# EAGLE schematic De-Humidifier revised (EAGLE 9.6.2)
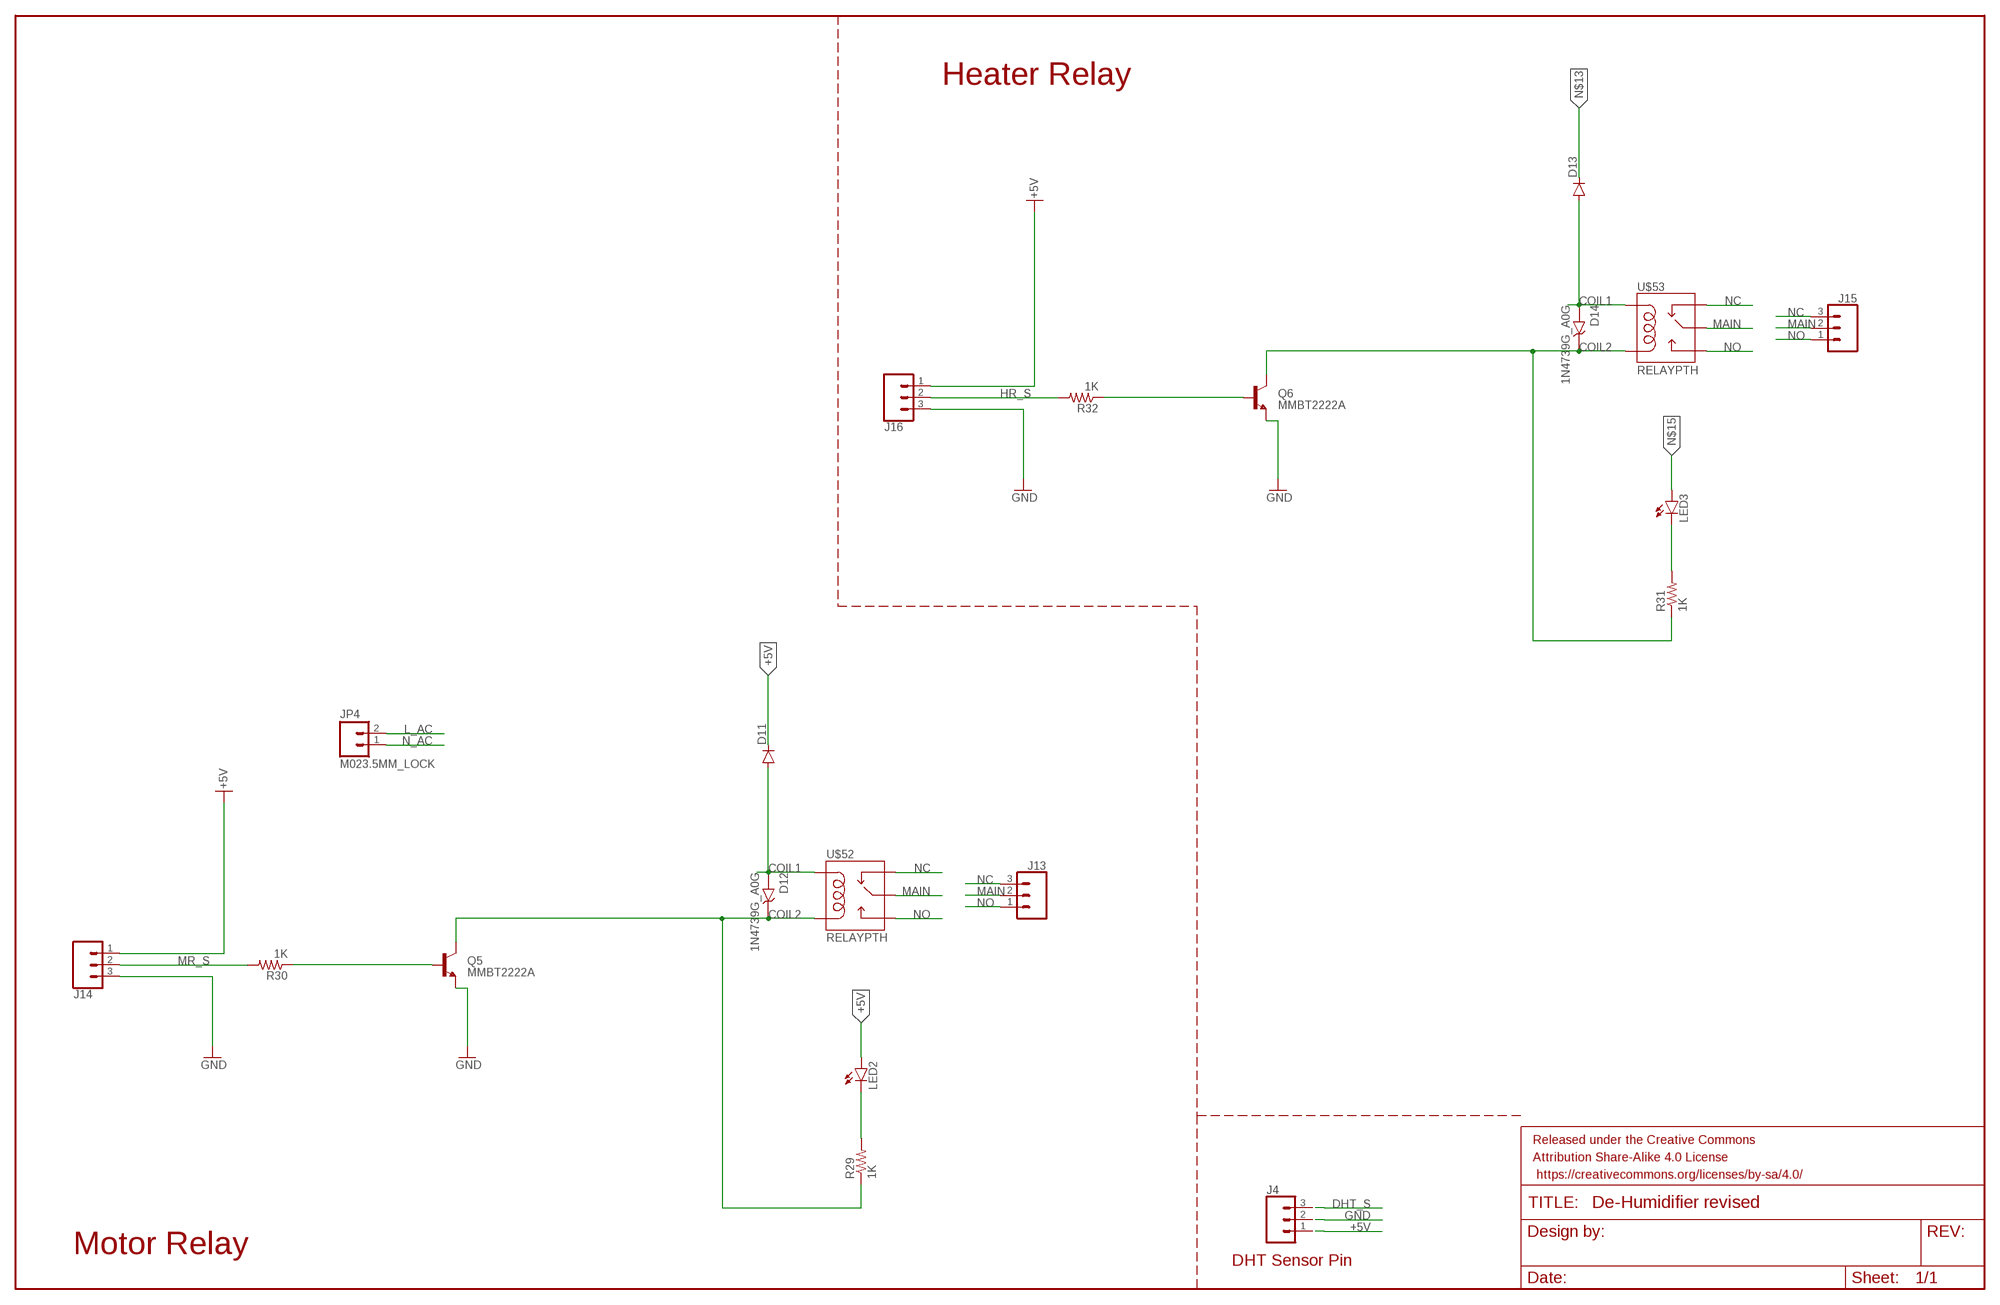
[diagram p0: schematic, sheet 1, part 1 of 2]
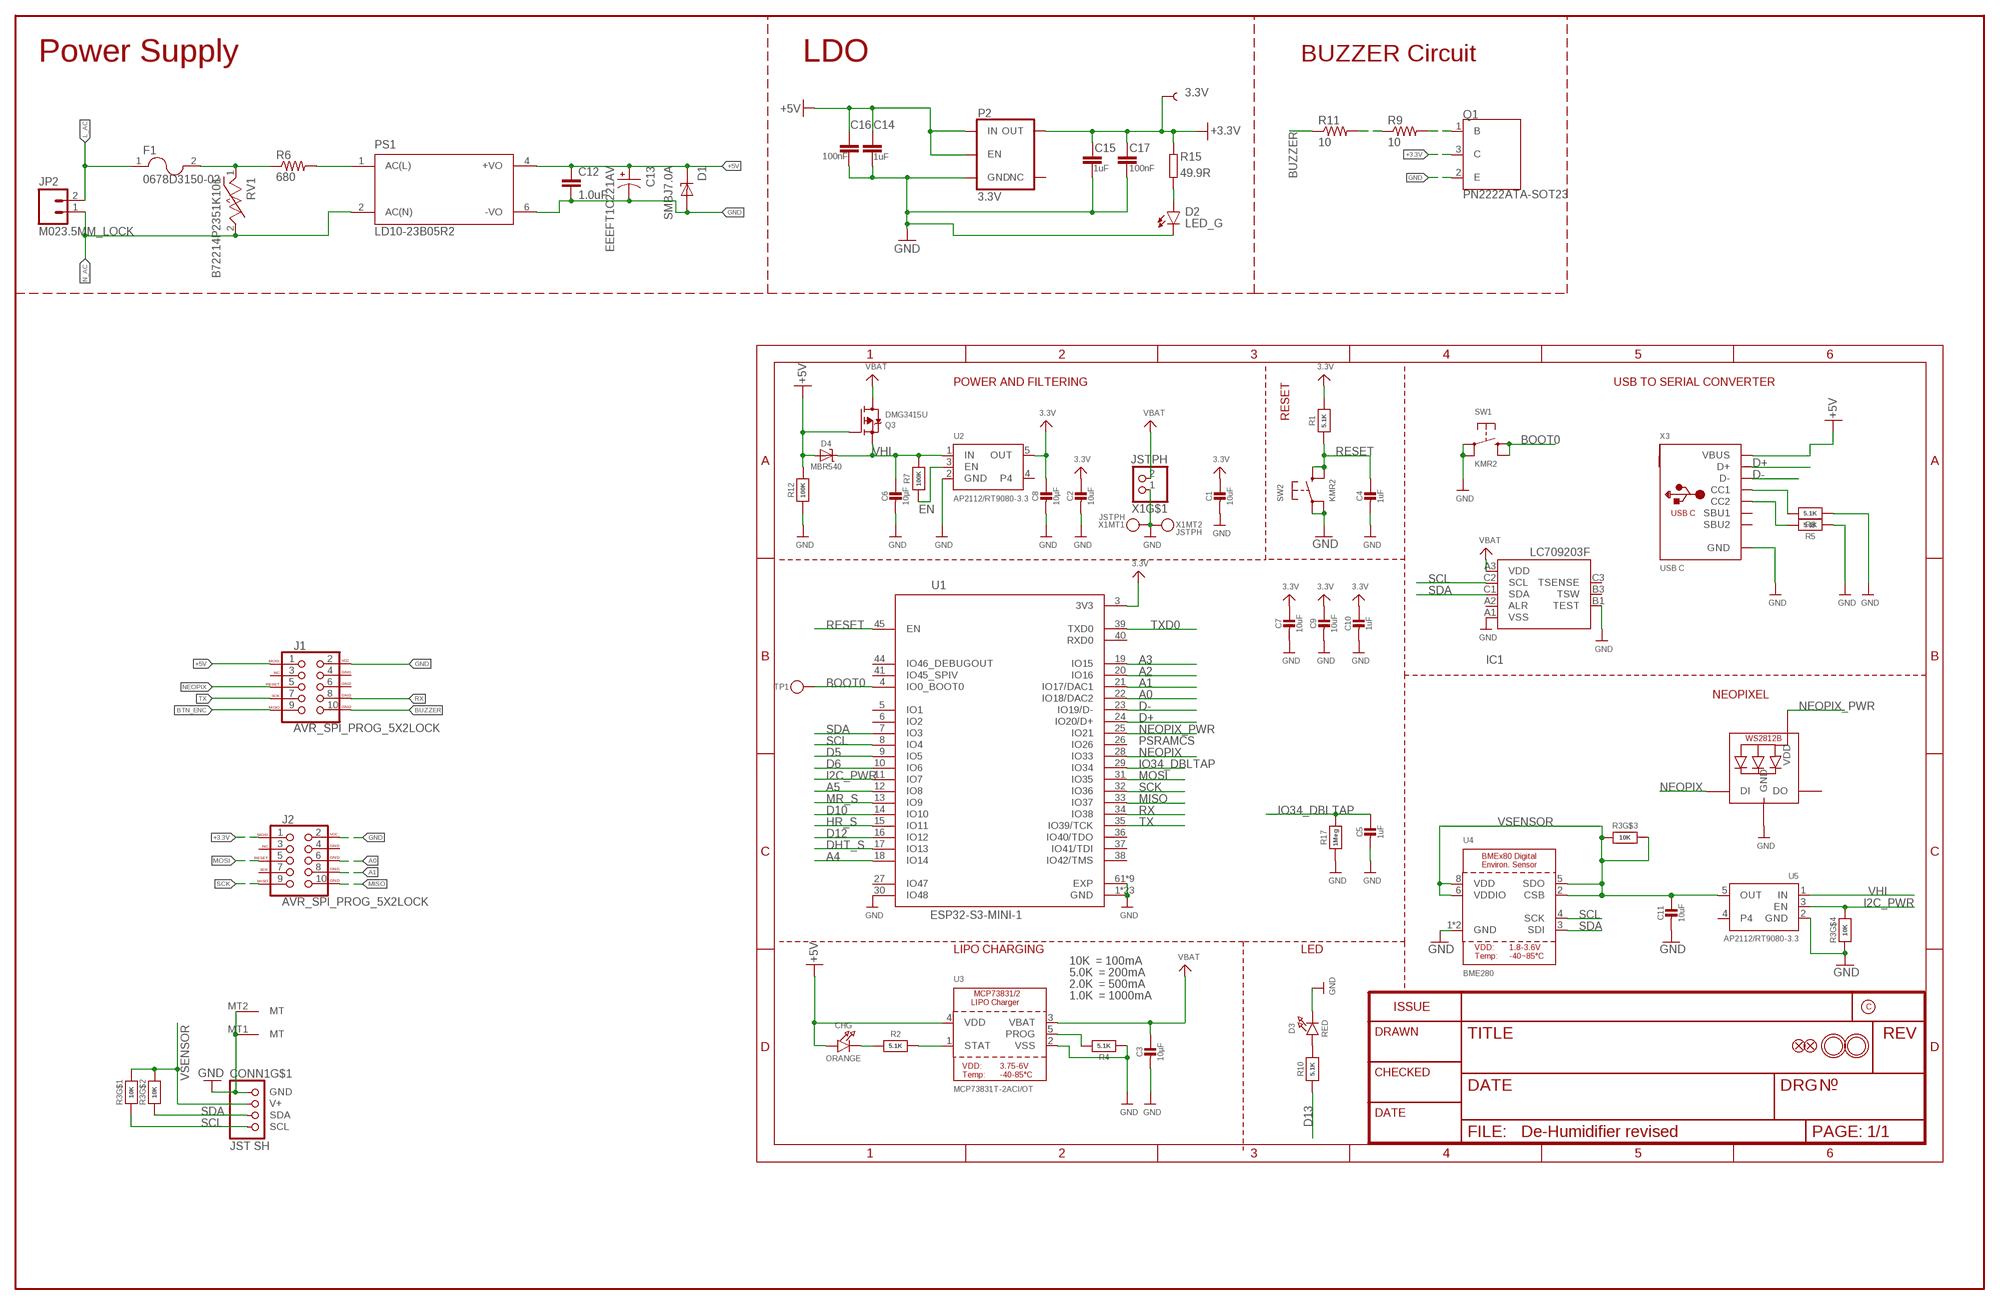
[diagram p1: schematic, sheet 1, part 2 of 2]

## Parts
3.3V  TEST-POINT3X4  [PAD.03X.04]
C1  10uF  CAP_CERAMIC0805-NOOUTLINE  [0805-NO]
C2  10uF  CAP_CERAMIC0805-NOOUTLINE  [0805-NO]
C3  10µF  CAP_CERAMIC0805-NOOUTLINE  [0805-NO]
C4  1uF  CAP_CERAMIC0603_NO  [0603-NO]
C5  1uF  CAP_CERAMIC0603_NO  [0603-NO]
C6  10µF  CAP_CERAMIC0805-NOOUTLINE  [0805-NO]
C7  10uF  CAP_CERAMIC0805-NOOUTLINE  [0805-NO]
C8  10µF  CAP_CERAMIC0805-NOOUTLINE  [0805-NO]
C9  10uF  CAP_CERAMIC0805-NOOUTLINE  [0805-NO]
C10  1uF  CAP_CERAMIC0603_NO  [0603-NO]
C11  10uF  CAP_CERAMIC_0805MP  [_0805MP]
C12  1.0uF  1.0UF-0805-25V-(+80/-20%)  [0805]
C13  EEEFT1C221AV  [CAP_EEEFT1C221AV]
C14  1uF  C_CHIP-0402(1005-METRIC)  [CAPC1005X60]
C15  1uF  C_CHIP-0402(1005-METRIC)  [CAPC1005X60]
C16  100nF  C_CHIP-0402(1005-METRIC)  [CAPC1005X60]
C17  100nF  C_CHIP-0402(1005-METRIC)  [CAPC1005X60]
CHG  ORANGE  LED0603_NOOUTLINE  [CHIPLED_0603_NOOUTLINE]
CONN1  JST SH  STEMMA_I2C_QTRA  [JST_SH4_RA]
D1  SMBJ7.0A  [DIOM4336X265N]
D2  LED_G  CHIP-FLAT-G_0603-0.35MM  [LEDC1608X35N_FLAT-G]
D3  RED  LED0603_NOOUTLINE  [CHIPLED_0603_NOOUTLINE]
D4  MBR540  DIODE-SCHOTTKYSOD-123  [SOD-123]
D11  DIODEKIT  [DIODE-1N4148-KIT]
D12  1N4739G_A0G  [DIOAD1036W73L450D282]
D13  DIODEKIT  [DIODE-1N4148-KIT]
D14  1N4739G_A0G  [DIOAD1036W73L450D282]
F1  0678D3150-02  [FUSC9830X318N]
FRAME2  FRAME-LEDGER  [CREATIVE_COMMONS]
FRAME3  FRAME-LEDGER  [CREATIVE_COMMONS]
IC1  LC709203F/MH  [WLCSP9]
J1  AVR_SPI_PROG_5X2LOCK  [2X5-SHROUDED_LOCK]
J2  AVR_SPI_PROG_5X2LOCK  [2X5-SHROUDED_LOCK]
J4  CONN_03LONGPADS  [1X03_LONGPADS]
J13  CONN_03-SCREW-5MM  [SCREWTERMINAL-5MM-3]
J14  CONN_03-SCREW-5MM  [SCREWTERMINAL-5MM-3]
J15  CONN_03-SCREW-5MM  [SCREWTERMINAL-5MM-3]
J16  CONN_03-SCREW-5MM  [SCREWTERMINAL-5MM-3]
JP2  M023.5MM_LOCK  [SCREWTERMINAL-3.5MM-2_LOCK]
JP4  M023.5MM_LOCK  [SCREWTERMINAL-3.5MM-2_LOCK]
LED1  WS2812B_SK6805_1515  [SK6805_1515]
LED2  LED-FKIT-1206  [FKIT-LED-1206]
LED3  LED-FKIT-1206  [FKIT-LED-1206]
P2  3.3V  V_REG_AP2112K-3.3V  [SOT23-5]
PS1  LD10-23B05R2  [CONV_LD10-23B05R2]
Q1  PN2222ATA-SOT23  [SOT23-3]
Q3  DMG3415U  MOSFET-P  [SOT23-R]
Q5  MMBT2222A  TRANSISTOR_NPNMMBT2222A  [SOT23-3]
Q6  MMBT2222A  TRANSISTOR_NPNMMBT2222A  [SOT23-3]
R1  5.1K  RESISTOR_0603_NOOUT  [0603-NO]
R2  5.1K  RESISTOR_0603_NOOUT  [0603-NO]
R3  10K  RESISTOR_4PACK  [RESPACK_4X0603]
R4  5.1K  RESISTOR_0603_NOOUT  [0603-NO]
R5  5.1K  RESISTOR_0603_NOOUT  [0603-NO]
R6  680  680OHM1/10W5%(0603)  [0603-RES]
R7  100K  RESISTOR_0603_NOOUT  [0603-NO]
R8  5.1K  RESISTOR_0603_NOOUT  [0603-NO]
R9  10  10OHM1/10W5%0603SMD  [0603-RES]
R10  5.1K  RESISTOR_0603_NOOUT  [0603-NO]
R11  10  10OHM1/10W5%0603SMD  [0603-RES]
R12  100K  RESISTOR_0603_NOOUT  [0603-NO]
R15  49.9R  R_CHIP-0402(1005-METRIC)  [RESC1005X40]
R17  1Meg  RESISTOR_0603_NOOUT  [0603-NO]
R29  1K  1KOHM1/10W1%(0603)  [0603-RES]
R30  1K  1KOHM1/10W1%(0603)  [0603-RES]
R31  1K  1KOHM1/10W1%(0603)  [0603-RES]
R32  1K  1KOHM1/10W1%(0603)  [0603-RES]
RV1  B72214P2351K101  [VAR_B72214P2351K101]
SW1  KMR2  SWITCH_TACT_SMT4.6X2.8  [BTN_KMR2_4.6X2.8]
SW2  KMR2  SWITCH_TACT_SMT4.6X2.8  [BTN_KMR2_4.6X2.8]
TP1  TESTPOINTROUND1.5MMNO  [TESTPOINT_ROUND_1.5MM_NO]
U1  ESP32-S3-MINI-1  [QFN60_ESP32-S2-MINI-1_EXP]
U2  AP2112/RT9080-3.3  VREG_SOT23-5  [SOT23-5]
U3  MCP73831T-2ACI/OT  MCP73831/2  [SOT23-5]
U4  BME280  [BME280]
U5  AP2112/RT9080-3.3  VREG_SOT23-5  [SOT23-5]
U$31  MOUNTINGHOLE2.5  [MOUNTINGHOLE_2.5_PLATED]
U$32  MOUNTINGHOLE2.5  [MOUNTINGHOLE_2.5_PLATED]
U$34  FIDUCIAL_1MM  [FIDUCIAL_1MM]
U$35  FIDUCIAL_1MM  [FIDUCIAL_1MM]
U$52  RELAYPTH  [RELAY-G5Q]
U$53  RELAYPTH  [RELAY-G5Q]
X1  JSTPH  CON_JST_PH_2PIN_MT_BATT  [JSTPH2_BATT]
X3  USB C  USB_C  [USB_C_CUSB31-CFM2AX-01-X]

## Nets
3.3V: C1.1 C2.1 C7.1 C8.1 C9.1 C10.1 R1.2 U1.3(3V3) U2.5(OUT)
+3.3V: 3.3V.P$1 C15.1 C17.1 J2.1(MOSI) P2.5(OUT) Q1.3(C) R15.2
+5V: C12.1 C13.1 C14.1 C16.1 CHG.A D1.C D4.A D11.C J1.1(MOSI) J4.1 J14.1 J16.1 LED2.A P2.1(IN) P2.3(EN) PS1.4(+VO) Q3.1(G) R12.2 U3.4(VDD) X3.A4B9(VBUS) X3.B4A9(VBUS)
A0: J2.6(GND) U1.22(IO18/DAC2)
A1: J2.8(GND) U1.21(IO17/DAC1)
A2: U1.20(IO16)
A3: U1.19(IO15)
A4: U1.18(IO14)
A5: U1.12(IO8)
BOOT0: SW1.B'(S1) SW1.B(S) TP1.P$1 U1.4(IO0_BOOT0)
BTN_ENC: J1.9(MISO)
BUZZER: J1.10(GND) R11.1
COIL1: D11.A D12.A D13.A D14.A U$52.5(COIL1) U$53.5(COIL1)
COIL2: D12.C(K) D14.C(K) Q5.3(C) Q6.3(C) R29.1 R31.1 U$52.1(COIL2) U$53.1(COIL2)
D5: U1.9(IO5)
D6: U1.10(IO6)
D10: U1.14(IO10)
D12: U1.16(IO12)
D13: R10.1
D+: U1.24(IO20/D+) X3.A6(D+) X3.B6(D+)
D-: U1.23(IO19/D-) X3.A7(D-) X3.B7(D-)
DHT_S: J4.3 U1.17(IO13)
EN: R7.1 U2.3(EN)
GND: C1.2 C2.2 C3.2 C4.2 C5.2 C6.2 C7.2 C8.2 C9.2 C10.2 C11.2 C12.2 C13.2 C14.2 C15.2 C16.2 C17.2 CONN1.1(GND) CONN1.MT1(MT) CONN1.MT2(MT) D1.A D2.C D3.C IC1.A1(VSS) IC1.B1(TEST) J1.2(VCC) J2.2(VCC) J4.2 J14.3 J16.3 LED1.4(GND) P2.2(GND) PS1.6(-VO) Q1.2(E) Q5.2(E) Q6.2(E) R3.4 R4.1 R5.1 R8.1 R12.1 R17.1 SW1.A'(P1) SW1.A(P) SW2.A'(P1) SW2.A(P) U1.1(GND) U1.2(GND) U1.30(IO48) U1.42(GND) U1.43(GND) U1.46(GND) U1.47(GND) U1.48(GND) U1.49(GND) U1.50(GND) U1.51(GND) U1.52(GND) U1.53(GND) U1.54(GND) U1.55(GND) U1.56(GND) U1.57(GND) U1.58(GND) U1.59(GND) U1.60(GND) U1.61(EXP) U1.62(GND) U1.63(GND) U1.64(GND) U1.65(GND) U1.66(EXP) U1.67(EXP) U1.68(EXP) U1.69(EXP) U1.70(EXP) U1.71(EXP) U1.72(EXP) U1.73(EXP) U2.2(GND) U3.2(VSS) U4.1(GND) U4.7(GND) U5.2(GND) X1.1 X1.NC1 X1.NC2 X3.A1B12(GND) X3.B1A12(GND)
HR_S: J16.2 R32.2 U1.15(IO11)
I2C_PWR: R3.5 U1.11(IO7) U5.3(EN)
IO34_DBLTAP: C5.1 R17.2 U1.29(IO34)
L_AC: F1.1 JP2.2 JP4.2
MAIN: J13.2 J15.2 U$52.2(MAIN) U$53.2(MAIN)
MISO: J2.10(GND) U1.33(IO37)
MOSI: J2.5(RESET) U1.31(IO35)
MR_S: J14.2 R30.2 U1.13(IO9)
N$1: CHG.C R2.1
N$2: F1.2 R6.1 RV1.1
N$3: R2.2 U3.1(STAT)
N$4: R4.2 U3.5(PROG)
N$5: D3.A R10.2
N$6: PS1.1(AC(L)) R6.2
N$7: Q1.1(B) R9.2
N$8: R8.2 X3.A5(CC1)
N$9: R5.2 X3.B5(CC2)
N$10: R9.1 R11.2
N$12: D2.A R15.1
N$13: D13.C
N$15: LED3.A
N$37: LED2.C R29.2
N$38: Q5.1(B) R30.1
N$40: LED3.C R31.2
N$41: Q6.1(B) R32.1
N_AC: JP2.1 JP4.1 PS1.2(AC(N)) RV1.2
NC: J13.3 J15.3 U$52.4(NC) U$53.4(NC)
NEOPIX: J1.5(RESET) LED1.1(DI) U1.28(IO33)
NEOPIX_PWR: LED1.2(VDD) U1.25(IO21)
NO: J13.1 J15.1 U$52.3(NO) U$53.3(NO)
RESET: C4.1 R1.1 SW2.B'(S1) SW2.B(S) U1.45(EN)
RX: J1.8(GND) U1.34(IO38)
SCK: J2.9(MISO) U1.32(IO36)
SCL: CONN1.4(SCL) IC1.C2(SCL) R3.1 U1.8(IO4) U4.4(SCK)
SDA: CONN1.3(SDA) IC1.C1(SDA) R3.2 U1.7(IO3) U4.3(SDI)
TX: J1.7(SCK) U1.35(IO39/TCK)
TXD0: U1.39(TXD0)
VBAT [Power]: C3.1 IC1.A3(VDD) Q3.3(D) U3.3(VBAT) X1.2
VHI [Power]: C6.1 D4.C Q3.2(S) R7.2 U2.1(IN) U5.1(IN)
VSENSOR [Power]: C11.1 CONN1.2(V+) R3.3 R3.6 R3.7 R3.8 U4.2(CSB) U4.5(SDO) U4.6(VDDIO) U4.8(VDD) U5.5(OUT)
Unconnected: IC1.A2(ALR) IC1.B3(TSW) IC1.C3(TSENSE) J1.3(NC) J2.3(NC) J2.7(SCK) LED1.3(DO) P2.4(NC) U1.5(IO1) U1.6(IO2) U1.26(IO26) U1.27(IO47) U1.36(IO40/TDO) U1.37(IO41/TDI) U1.38(IO42/TMS) U1.40(RXD0) U1.41(IO45_SPIV) U1.44(IO46_DEBUGOUT) U2.4 U5.4 X3.A8(SBU1) X3.B8(SBU2)

## Notes on the sheet
- Heater Relay
- Motor Relay
- DHT Sensor Pin
- Power Supply | LDO | BUZZER Circuit
- POWER AND FILTERING | USB TO SERIAL CONVERTER
- RESET
- NEOPIXEL
- PSRAMCS
- LIPO CHARGING | LED
- 10K  = 100mA
- 5.0K  = 200mA
- 2.0K  = 500mA
- 1.0K  = 1000mA

## Power pins joined to a net without a drawn wire
GND: J1.4(GND) J1.6(GND) J2.4(GND)

## Library data of the parts
3.3V = SparkFun-Connectors:TEST-POINT: SparkFun Test Points Bare copper test points for troubleshooting or In-Circuit-Testing. These are used by our Production team for verifying production board runs using pogo-pins on test beds. SparkFun Products: SparkFun LSM9DS1 Breakout <https://www.sparkfun.com/products/13284> SparkFun PSOC <https://www.sparkfun.com/products/13714> SparkFun Load Cell Amplifier <https://www.sparkfun.com/products/13879>
C1-C7 C9-C11 = microbuilder:CAP_CERAMIC: Ceramic Capacitors For new designs, use the packages preceded by an '_' character since they are more reliable: The following footprints should be used on most boards: _0402 - Standard footprint for regular board layouts _0603 - Standard footprint for regular board layouts _0805 - Standard footprint for regular board layouts _1206 - Standard footprint for regular board layouts For extremely tight-pitch boards where space is at a premium, the following 'micro-pitch' footprints can be used (smaller pads, no silkscreen outline, etc.): _0402MP - Micro-pitch footprint for very dense/compact boards _0603MP - Micro-pitch footprint for very dense/compact boards _0805MP - Micro-pitch footprint for very dense/compact boards _1206MP - Micro-pitch footprint for very dense/compact boards
C8 = microbuilder:CAP_CERAMIC: Ceramic Capacitors For new designs, use the packages preceded by an '_' character since they are more reliable: The following footprints should be used on most boards: _0402 - Standard footprint for regular board layouts _0603 - Standard footprint for regular board layouts _0805 - Standard footprint for regular board layouts _1206 - Standard footprint for regular board layouts For extremely tight-pitch boards where space is at a premium, the following 'micro-pitch' footprints can be used (smaller pads, no silkscreen outline, etc.): _0402MP - Micro-pitch footprint for very dense/compact boards _0603MP - Micro-pitch footprint for very dense/compact boards _0805MP - Micro-pitch footprint for very dense/compact boards _1206MP - Micro-pitch footprint for very dense/compact boards; REV: C
C12 = SparkFun-Capacitors:1.0UF: 1µF ceramic capacitors A capacitor is a passive two-terminal electrical component used to store electrical energy temporarily in an electric field.; PROD_ID: CAP-11625
C13 = EEEFT1C221AV:EEEFT1C221AV: Check availability <https://pricing.snapeda.com/parts/EEE-FT1C221AV/Panasonic%20Electronic%20Components/view-part?ref=eda>; AVAILABILITY: In Stock; CHECK_PRICES: https://www.snapeda.com/parts/EEE-FT1C221AV/Panasonic/view-part/?ref=eda; DESCRIPTION: CAP ALUM 220UF 20% 16V SMD; MF: Panasonic Electronic Components; MP: EEE-FT1C221AV; PACKAGE: RADIAL-2 Panasonic; PRICE: None; PURCHASE-URL: https://www.snapeda.com/api/url_track_click_mouser/?unipart_id=6178542&manufacturer=Panasonic Electronic Components&part_name=EEE-FT1C221AV&search_term=220uf 16v; SNAPEDA_LINK: https://www.snapeda.com/parts/EEE-FT1C221AV/Panasonic/view-part/?ref=snap
C14 C15 = Fracktal Misc Lib:C: Capacitor - Generic; CATEGORY: Capacitor; LCSCPN#: C52923
C16 C17 = Fracktal Misc Lib:C: Capacitor - Generic; CATEGORY: Capacitor; LCSCPN#: C307331
CHG D3 = microbuilder:LED: LED 0603 - 0603 Surface Mount Package 2mA: Green LED - Low Power (3.9mcd, 2ma, 1.7Vf) - Digikey: 475-2709-2-ND Orange LED - Low Power (9.8mcd, 2ma, 1.8Vf) - Digikey: 475-1194-2-ND Red LED - Low Power (5mcd, 2ma, 1.8Vf) - Digikey: 475-1195-2-ND Yellow LED - Low Power (7mcd, 2ma, 1.8Vf) - Digikey: 475-1196-2-ND 5mA: Blue LED - Low Power (17mcd, 5ma, 2.9Vf) - Digikey: LNJ937W8CRACT-ND 0805 - 0805 Surface Mount Package 2mA: Red LED (8.8mcd, 2mA, 1.8Vf, Clear) - Low Power [Digikey: 475-2510-1-ND] Green LED (5mcd, 2mA, 1.8Vf, Clear) - Low Power [Digikey: 475-2730-1-ND] Yellow LED (11.3mcd, 2mA, 1.8Vf, Clear) - Low Power [Digikey: 475-2555-1-ND] 20mA: Red LED (104mcd, 20mA, Diffused) - LS R976 [Digikey: 475-1278-6-ND] Red LED (12mcd, 20mA, 2.0Vf, Clear) - APT2012EC [Digikey: 754-1128-1-ND] Green LED (15mcd, 20mA, 2.2Vf, Clear) - APT2012GC [Digikey: 754-1131-1-ND] Orange LED (160mcd, 20mA, 2.1Vf, Clear) - APT2012SECK [Digikey: 754-1130-1-ND] 1206 - 1206 Surface Mount Package Green LED (26mcd, 20mA, Diffused) - LG N971 [Digikey: 475-1407-6-ND] Red LED (15mcd, 20mA, Diffused) - LH N974 [Digikey: 475-1416-6-ND] Cree - Cree High-Power Surface Mount LEDs XPEBWT-L1-0000-00D50 - White 111lm 350mA 2.9Vf 6200K 110° XTEAWT-00-0000-00000LEE3 - White 114lm 350mA 2.85Vf 5000K 115° Everlight - Everlight 45-21 Series Surface Mount LEDs 45-21/QK2C-B2832AC2CB2/2T - Warm White 2000mcd 20mA 3.25Vf 3050K 120° 45-21/LK2C-B38452C4CB2/2T - Nuetral White 2000mcd 20mA 3.25Vf 4150K 120° 45-21/LK2C-B50634C6CB2/2T - Cold White 2200mcd 20mA 3.25Vf 5650K 120° PLCC2 Reverse Mount LS T77K-J1L2-1-0-2-R18-Z - Red 11.25mcd 2mA 1.8Vf 630nm 120° LO T77K-L1M2-24-Z - Orange 19.6mcd 2mA 1.8Vf 606nm 120° LY T77K-K2M1-26-Z - Yellow 15.7mcd 2mA 1.8Vf 587nm 120°
CONN1 = microbuilder:STEMMA_I2C
D1 = SMBJ7.0A:SMBJ7.0A: Check availability <https://pricing.snapeda.com/parts/SMBJ7.0A/Littelfuse/view-part?ref=eda>; AVAILABILITY: In Stock; CHECK_PRICES: https://www.snapeda.com/parts/SMBJ7.0A/Littelfuse/view-part/?ref=eda; DESCRIPTION: 600W Surface Mount TVS Diode | Littelfuse SMBJ7.0A; MF: Littelfuse; MP: SMBJ7.0A; PACKAGE: DO-214 Littelfuse; PRICE: None; PURCHASE-URL: https://www.snapeda.com/api/url_track_click_mouser/?unipart_id=185729&manufacturer=Littelfuse&part_name=SMBJ7.0A&search_term=smbj7.0a; SNAPEDA_LINK: https://www.snapeda.com/parts/SMBJ7.0A/Littelfuse/view-part/?ref=snap
D2 = LED:CHIP-FLAT-G; CATEGORY: LED; COLOR: GREEN; DESCRIPTION: CHIP LED FLAT; LCSCPN#: C72043; SUB-CATEGORY: CHIP; TYPE: FLAT_TOP; VALUE: LED_GREEN
D4 = microbuilder:DIODE-SCHOTTKY
D11 D13 = SparkFun-DiscreteSemi:DIODE: Diode These are standard reverse protection diodes and small signal diodes. SMA package can handle up to about 1A. SOD-323 can handle about 200mA. What the SOD-323 package when ordering, there are some mfgs out there that are 5-pin packages.
D12 D14 = 1N4739G_A0G:1N4739G_A0G: Check availability <https://pricing.snapeda.com/parts/1N4739G%20A0G/Taiwan%20Semiconductor/view-part?ref=eda>; AVAILABILITY: In Stock; CHECK_PRICES: https://www.snapeda.com/parts/1N4739G%20A0G/Taiwan+Semiconductor/view-part/?ref=eda; DESCRIPTION: DO-204AL (DO-41), 1000mW, 5%, Small Signal Zener Diode; MF: Taiwan Semiconductor; MP: 1N4739G A0G; PACKAGE: DO-41-2 Taiwan Semiconductor; PRICE: None; PURCHASE-URL: https://www.snapeda.com/api/url_track_click_mouser/?unipart_id=9408030&manufacturer=Taiwan Semiconductor&part_name=1N4739G A0G&search_term=1n4739; SNAPEDA_LINK: https://www.snapeda.com/parts/1N4739G%20A0G/Taiwan+Semiconductor/view-part/?ref=snap
F1 = 0678D3150-02:0678D3150-02: Surface mount "brick" | Ceramic Tube | 3912 case size | Fast Acting | 500mA Check availability <https://pricing.snapeda.com/parts/0678D3150-02/Bel%20Fuse/view-part?ref=eda>; AVAILABILITY: In Stock; CHECK_PRICES: https://www.snapeda.com/parts/0678D3150-02/Bel+Fuse/view-part/?ref=eda; DESCRIPTION: Surface mount brick | Ceramic Tube | 3912 case size | Fast Acting | 3.15A; MF: Bel Fuse; MP: 0678D3150-02; PACKAGE: SMD-2 Bel Fuse Inc.; PRICE: None; PURCHASE-URL: https://www.snapeda.com/api/url_track_click_mouser/?unipart_id=4616239&manufacturer=Bel Fuse&part_name=0678D3150-02&search_term=0678d3150-02; SNAPEDA_LINK: https://www.snapeda.com/parts/0678D3150-02/Bel+Fuse/view-part/?ref=snap
FRAME2 FRAME3 = SparkFun-Aesthetics:FRAME-LEDGER: Schematic Frame Standard 11x14 US Ledger frame
IC1 = adafruit_sensor:LC709203F
J1 J2 = SparkFun-Connectors:AVR_SPI_PROG_5X2: AVR 10-pin ICSP Header This is the standard AVR In Circuit Serial Programming header. Minimal, but includes pin one indicator. Works with standard Olimex programmers. SparkFun Products: 2x5 AVR ICSP Male Header <https://www.sparkfun.com/products/778> - PTH 2x5 Pin Shrouded Header <https://www.sparkfun.com/products/8506> - PTH2; PROD_ID: CONN-08671; SF_ID: PRT-08506
J4 = SparkFun-Connectors:CONN_03: Multi connection point. Often used as Generic Header-pin footprint for 0.1 inch spaced/style header connections On any of the 0.1 inch spaced packages, you can populate with these: Break Away Headers - Straight <https://www.sparkfun.com/products/116> (PRT-00116) Break Away Male Headers - Right Angle <https://www.sparkfun.com/products/553> (PRT-00553) Female Headers <https://www.sparkfun.com/products/115> (PRT-00115) Break Away Headers - Machine Pin <https://www.sparkfun.com/products/117> (PRT-00117) Break Away Female Headers - Swiss Machine Pin <https://www.sparkfun.com/products/743> (PRT-00743) Stackable Header - 3 Pin (Female, 0.1") <https://www.sparkfun.com/products/13875> (PRT-13875) For SCREWTERMINALS and SPRING TERMINALS visit here: Screw Terimnals on SparkFun.com <https://www.sparkfun.com/search/results?term=Screw+Terminals> (5mm/3.5mm/2.54mm spacing) This device is also useful as a general connection point to wire up your design to another part of your project. Our various solder wires solder well into these plated through hole pads. Hook-Up Wire - Assortment (Stranded, 22 AWG) <https://www.sparkfun.com/products/11375> (PRT-11375) Hook-Up Wire - Assortment (Solid Core, 22 AWG) <https://www.sparkfun.com/products/11367> (PRT-11367) View the entire wire category on our website here <https://www.sparkfun.com/categories/141> Special notes: Molex polarized connector foot print use with SKU : PRT-08232 with associated crimp pins and housings.
J13-J16 = SparkFun-Connectors:CONN_03: Multi connection point. Often used as Generic Header-pin footprint for 0.1 inch spaced/style header connections On any of the 0.1 inch spaced packages, you can populate with these: Break Away Headers - Straight <https://www.sparkfun.com/products/116> (PRT-00116) Break Away Male Headers - Right Angle <https://www.sparkfun.com/products/553> (PRT-00553) Female Headers <https://www.sparkfun.com/products/115> (PRT-00115) Break Away Headers - Machine Pin <https://www.sparkfun.com/products/117> (PRT-00117) Break Away Female Headers - Swiss Machine Pin <https://www.sparkfun.com/products/743> (PRT-00743) Stackable Header - 3 Pin (Female, 0.1") <https://www.sparkfun.com/products/13875> (PRT-13875) For SCREWTERMINALS and SPRING TERMINALS visit here: Screw Terimnals on SparkFun.com <https://www.sparkfun.com/search/results?term=Screw+Terminals> (5mm/3.5mm/2.54mm spacing) This device is also useful as a general connection point to wire up your design to another part of your project. Our various solder wires solder well into these plated through hole pads. Hook-Up Wire - Assortment (Stranded, 22 AWG) <https://www.sparkfun.com/products/11375> (PRT-11375) Hook-Up Wire - Assortment (Solid Core, 22 AWG) <https://www.sparkfun.com/products/11367> (PRT-11367) View the entire wire category on our website here <https://www.sparkfun.com/categories/141> Special notes: Molex polarized connector foot print use with SKU : PRT-08232 with associated crimp pins and housings.; PROD_ID: CONN-10134; SF_SKU: PRT-08433
JP2 JP4 = SparkFun-Connectors:M02: Standard 2-pin 0.1" header. Use with - straight break away headers ( PRT-00116) - right angle break away headers (PRT-00553) - swiss pins (PRT-00743) - machine pins (PRT-00117) - female headers (PRT-00115) Molex polarized connector foot print use with: PRT-08233 with associated crimp pins and housings. 2.54_SCREWTERM for use with PRT-10571. 3.5mm Screw Terminal footprints for PRT-08084 5mm Screw Terminal footprints for use with PRT-08432
LED1 = microbuilder:WS2812B
LED2 LED3 = SparkFun-LED:LED: LEDs Standard schematic elements and footprints for 5mm, 3mm, 1206, and 0603 sized LEDs. 5mm - Spark Fun Electronics SKU : COM-00529 (and others)
P2 = SparkFun-IC-Power:V_REG_AP2112: AP2112 - 600mA CMOS LDO Regulator w/ Enable The AP2112 is CMOS process low dropout linear regulator with enable function, the regulator delivers a guaranteed 600mA (min.) continuous load current. Features Output Voltage Accuracy: ±1.5% Output Current: 600mA (Min.) Foldback Short Current Protection: 50mA Enable Function to Turn ON/OFF VOUT Low Dropout Voltage (3.3V): 250mV (Typ.) @IOUT=600mA Excellent Load Regulation: 0.2%/A (Typ.) Excellent Line Regulation: 0.02%/V (Typ.) Low Quiescent Current: 55μA (Typ.) Low Standby Current: 0.01μA (Typ.) Low Output Noise: 50μVRMS PSRR: 100Hz -65dB, 1kHz -65dB OTSD Protection Stable with 1.0μF Flexible Cap: Ceramic, Tantalum and Aluminum Electrolytic Operation Temperature Range: -40°C to 85°C ESD: MM 400V, HBM 4000V; LCSCPN#: C51118; PROD_ID: VREG-12457
PS1 = LD10-23B05R2:LD10-23B05R2: AC/DC Converter Check availability <https://pricing.snapeda.com/parts/LD10-23B05R2/Mornsun%20America%2C%20LLC/view-part?ref=eda>; AVAILABILITY: In Stock; CHECK_PRICES: https://www.snapeda.com/parts/LD10-23B05R2/MORNSUN/view-part/?ref=eda; DESCRIPTION: Enclosed AC DC Converters 1 Uitgang 5V - - - 2A 85 ~ 305 VAC, 100 ~ 430 VDC Input; MF: Mornsun America, LLC; MP: LD10-23B05R2; PACKAGE: CUSTOM-4 MORNSUN; PRICE: None; PURCHASE-URL: https://www.snapeda.com/api/url_track_click_mouser/?unipart_id=5507490&manufacturer=Mornsun America, LLC&part_name=LD10-23B05R2&search_term=None; SNAPEDA_LINK: https://www.snapeda.com/parts/LD10-23B05R2/MORNSUN/view-part/?ref=snap
Q1 = PN2222ATA:PN2222ATA: PN2222ATA transistor Check availability <https://pricing.snapeda.com/parts/PN2222ATA/onsemi/view-part?ref=eda>; AVAILABILITY: In Stock; CHECK_PRICES: https://www.snapeda.com/parts/PN2222ATA/Onsemi/view-part/?ref=eda; DESCRIPTION: Bipolar (BJT) Transistor NPN 40 V 1 A 300MHz 625 mW Through Hole TO-92-3; MF: onsemi; MP: PN2222ATA; PACKAGE: None; PRICE: None; PURCHASE-URL: https://www.snapeda.com/api/url_track_click_mouser/?unipart_id=7399020&manufacturer=onsemi&part_name=PN2222ATA&search_term=pn2222a w73; SNAPEDA_LINK: https://www.snapeda.com/parts/PN2222ATA/Onsemi/view-part/?ref=snap
Q3 = microbuilder:MOSFET-P: P-Channel Mosfet LEGEND VDS: Voltage Drain-Source ID: Drain Current RDS(ON): Drain-Source On-State Resistance VGS(TH): Gate-Source Threshold Voltage CISS: Drain-Source Input Capacitance SOT-23 Name VDS ID RDS(ON) VGS(TH) CISS Order Number IRLML5103 30V 760mA 600 mOhm -- 75pF @ 25V Digikey: IRLML5103PBFCT-ND IRLML6401 12V 4.3A 50 mOhm 950mV @ 250µA 830pF @ 10V Digikey: IRLML6401PBFTR-ND NTR0202PL 20V 400mA 800 mOhm 2.3V @ 250uA 70pF @ 5V Digikey: NTR0202PLT1GOSTR-ND NTR4101PT1G 20V 1.8A 85 mOhm 1.2V @ 250uA 675pF @ 10V Digikey: NTR4101PT1GOSCT-ND DMP2004K 20V 600mA 900 mOhm 1V @ 250uA 175pF @ 16V Digikey: DMP2004KDICT-ND PMV65XP 20V 3.9A 76 mOhm 950mV @ 1mA 725pF @ 20V Digikey: 568-2358-2-ND TO-252 Name VDS ID RDS(ON) VGS(TH) CISS Order Number AOD417 30V 25A 34 mOhm 3V @ 250µA 920pF @ 15V Digikey: 785-1106-2-ND PowerPak Name VDS ID RDS(ON) VGS(TH) CISS Order Number AON7401 30V 12A 14 mOhm 3V @ 250µA 2600pF @ 15V Digikey: 785-1302-1-ND
Q5 Q6 = SparkFun-DiscreteSemi:TRANSISTOR_NPN: Generic NPN BJT MMBT2222A - TRANS-08049 (SOT-23, 1A 40V) MPSA42 - TRANS-09116 (SOT-23, 500mA 300V) MMBT5088LT1G - TRANS-11160 (SOT-23, 50 mA 30V) BC547 - COM-08928 <http://www.sparkfun.com/products/8928> (TO-92 45V 100mA) (1.Collector 2.Base 3.Emitter) 2N3904 - COM-00521 <http://www.sparkfun.com/products/521> (TO-92 40V 200mA) (1.Emitter 2.Base 3.Collector) P2N2222A - COM-12852 <http://www.sparkfun.com/products/12852> (TO-92 40V 600mA) (1.Collector 2.Base 3.Emitter); PROD_ID: TRANS-08049
R1 R2 R4 R5 R7 R8 R10 R12 R17 = microbuilder:RESISTOR: Resistors For new designs, use the packages preceded by an '_' character since they are more reliable: The following footprints should be used on most boards: _0402 - Standard footprint for regular board layouts _0603 - Standard footprint for regular board layouts _0805 - Standard footprint for regular board layouts _1206 - Standard footprint for regular board layouts For extremely tight-pitch boards where space is at a premium, the following 'micro-pitch' footprints can be used (smaller pads, no silkscreen outline, etc.): _0402MP - Micro-pitch footprint for very dense/compact boards _0603MP - Micro-pitch footprint for very dense/compact boards _0805MP - Micro-pitch footprint for very dense/compact boards _1206MP - Micro-pitch footprint for very dense/compact boards
R3 = microbuilder:RESISTOR_4PACK: Resistor Packs (4 resistors) 4 x 0603 10K 1/16W - Digikey: YC164J-10KCT-ND
R6 = SparkFun-Resistors:680OHM1/10W5%(0603): RES-09333; PROD_ID: RES-09333
R9 R11 = SparkFun-Resistors:10OHM1/10W5%0603: RES-09834; PROD_ID: RES-09834
R15 = Fracktal Misc Lib:R: Resistor Fixed - Generic; CATEGORY: Resistor; LCSCPN#: C25120; SUB-CATEGORY: Fixed
R29-R32 = SparkFun-Resistors:1KOHM1/10W1%(0603): RES-07856; PROD_ID: RES-07856
RV1 = B72214P2351K101:B72214P2351K101: Check availability <https://pricing.snapeda.com/parts/B72214P2351K101/EPCOS/view-part?ref=eda>; AVAILABILITY: In Stock; CHECK_PRICES: https://www.snapeda.com/parts/B72214P2351K101/EPCOS/view-part/?ref=eda; DESCRIPTION: 560 V 6 kA Varistor 1 Circuit Through Hole Disc 16.5mm; MF: EPCOS; MP: B72214P2351K101; PACKAGE: Disc-16 EPCOS; PRICE: None; PURCHASE-URL: https://www.snapeda.com/api/url_track_click_mouser/?unipart_id=1312197&manufacturer=EPCOS&part_name=B72214P2351K101&search_term=560v mov; SNAPEDA_LINK: https://www.snapeda.com/parts/B72214P2351K101/EPCOS/view-part/?ref=snap
SW1 SW2 = microbuilder:SWITCH_TACT_SMT: SMT Tact Switches 6x6mm - Digikey: P12940SCT-ND KMR2 (4.6x2.8mm) - Digikey: 401-1426-1-ND EVQ-PQHB55 - Light Touch, 160GF (4.5x4.5mm) - Digikey: P8090SCT-ND KMT0 - KMT021 NGJ LHS (etc.) IP68/Waterproof - Digikey: CKN10289CT-ND
TP1 = microbuilder:TESTPOINT: Test Point Various test points for characterisation and PCB testing TESTPOINT_SMT - Compact Surface Mount Test Point [Digikey: 5016KTR-ND]
U1 = adafruit_wireless:ESP32-S3-MINI-1; BUILT_BY: EMA_Kyle; COPYRIGHT: Copyright (C) 2018 Accelerated Designs. All rights reserved; DATASHEET: https://www.espressif.com/sites/default/files/documentation/esp32-s2-mini-1_esp32-s2-mini-1u_datasheet_en.pdf; MANUFACTURER_PART_NUMBER: ESP32-S2-MINI-1; SOURCELIBRARY: Add_to_database_2020-11-03; VENDOR: Espressif Systems
U2 U5 = microbuilder:VREG_SOT23-5: SOT23-5 Fixed Voltage Regulators Part Current Out V Out V In V Dropout θJA (°C/W) TJ (°C) Digikey Part No. ADP121 150mA 3.3V 3.4-5.5V 0.09V @ 150mA -- -- ADP121-AUJZ33R7CT-ND ADP121 150mA 3.0V 3.1-5.5V 0.09V @ 150mA -- -- ADP121-AUJZ30R7CT-ND ADP122 300mA 3.3V 3.4-5.5V 0.085V @ 300mA -- -- ADP122AUJZ-3.3-R7CT-ND ADP1712 300mA 3.3V 3.5-5.5V 0.17V @ 300mA -- -- ADP1712AUJZ-3.3-R7TR-ND AP7311 (Low Cost) 150mA 3.3V 3.5-6V 0.15V @ 150mA -- -- AP7311-33WG-7DICT-ND LD39015M18R 150mA 1.8V 1.9V-5.5V 0.08V @ 100mA -- -- 497-6977-1-ND LP2985A-33DBVR 150mA 3.3V 3.3-16V 0.28V @ 150mA 206 150 296-18479-1-ND MCP1824T-3302E/OT 300mA 3.3V 3.5V-6V 0.2V @ 300mA -- -- MCP1824T-3302E/OTCT-ND MIC5205-2.5YM5 TR 150mA 2.5V 2.7-16V 0.165V @ 150mA -- -- 576-1257-2-ND MIC5205-3.0YM5 TR 150mA 3.0V 3.2V-16V 0.165V @ 150mA -- -- 576-1258-2-ND MIC5205-3.3YM5 TR 150mA 3.3V 3.5V-16V 0.165V @ 150mA -- -- 576-1259-2-ND TPS780330220 150mA 3.3V+2.2V 3.6-5.5V 250mV Max -- -- 296-23332-1-ND TDA3663/N1,135 100mA 3.3V 3.5-45V 0.18V @ 50mA -- -- 568-5343-1-ND Max operating temp can be calculated using θJA, TJ (max junction temperature), and power in watts. Set the "Maximum Ambient Temperature" until it reaches TJ ("Max Junction Temperature"), which is the absolute limit for safe use of the regulator: Heat Sink Temperature Calculator <http://www.daycounter.com/Calculators/Heat-Sink-Temperature-Calculator.phtml> For example, With 12V source into a 3.3V LP2985 and a 30mA load, we are dissipating (12V-3.3V) * 0.03A = 0.261W. With a θJA of 206 °C/W, a TJ of 150°C, and 261mW we can safely use the chip without a heat sink up to 75°C (=147.1°C Junction Temperature).
U3 = microbuilder:MCP73831/2: MCP73831/2 LIPO Charger VDD: 3.75 - 6V Temp -40 - 85°C Programmable Charge Rate: 15-500mA NOTE: STAT is a tri-state logic output on the MCP73831 and an open-drain output on the MCP73832. SOT23-5 with 4.2V output and tri-state logic on STAT = MCP73831T-2ACI/OT
U4 = adafruit_sensor:BME280: BME280 - Environmental Sensor (I2C + SPI)
U$31 U$32 = microbuilder:MOUNTINGHOLE: Mounting Hole For #2 screws (0.086"/2.18mm width, 0.094"/2.4mm hole) use 2.5mm; BOM: EXCLUDE
U$34 U$35 = microbuilder:FIDUCIAL: Fiducial Alignment Points Various fiducial points for machine vision alignment.; BOM: EXCLUDE
U$52 U$53 = SparkFun-Electromechanical:RELAY: SPDT relay (COM-00101)
X1 = adafruit_electromech:CON_JST_PH_2PIN_MT
X3 = adafruit_connector:USB_C: USB Type-C USB 2.0 Connector

## Net classes
3 Power: width 0.305 mm, drill 0.483 mm